# Altium schematic sheet IO_EXPAND.SchDoc
size 420 x 297 mm; SheetNumber: 10; SheetTotal: 19
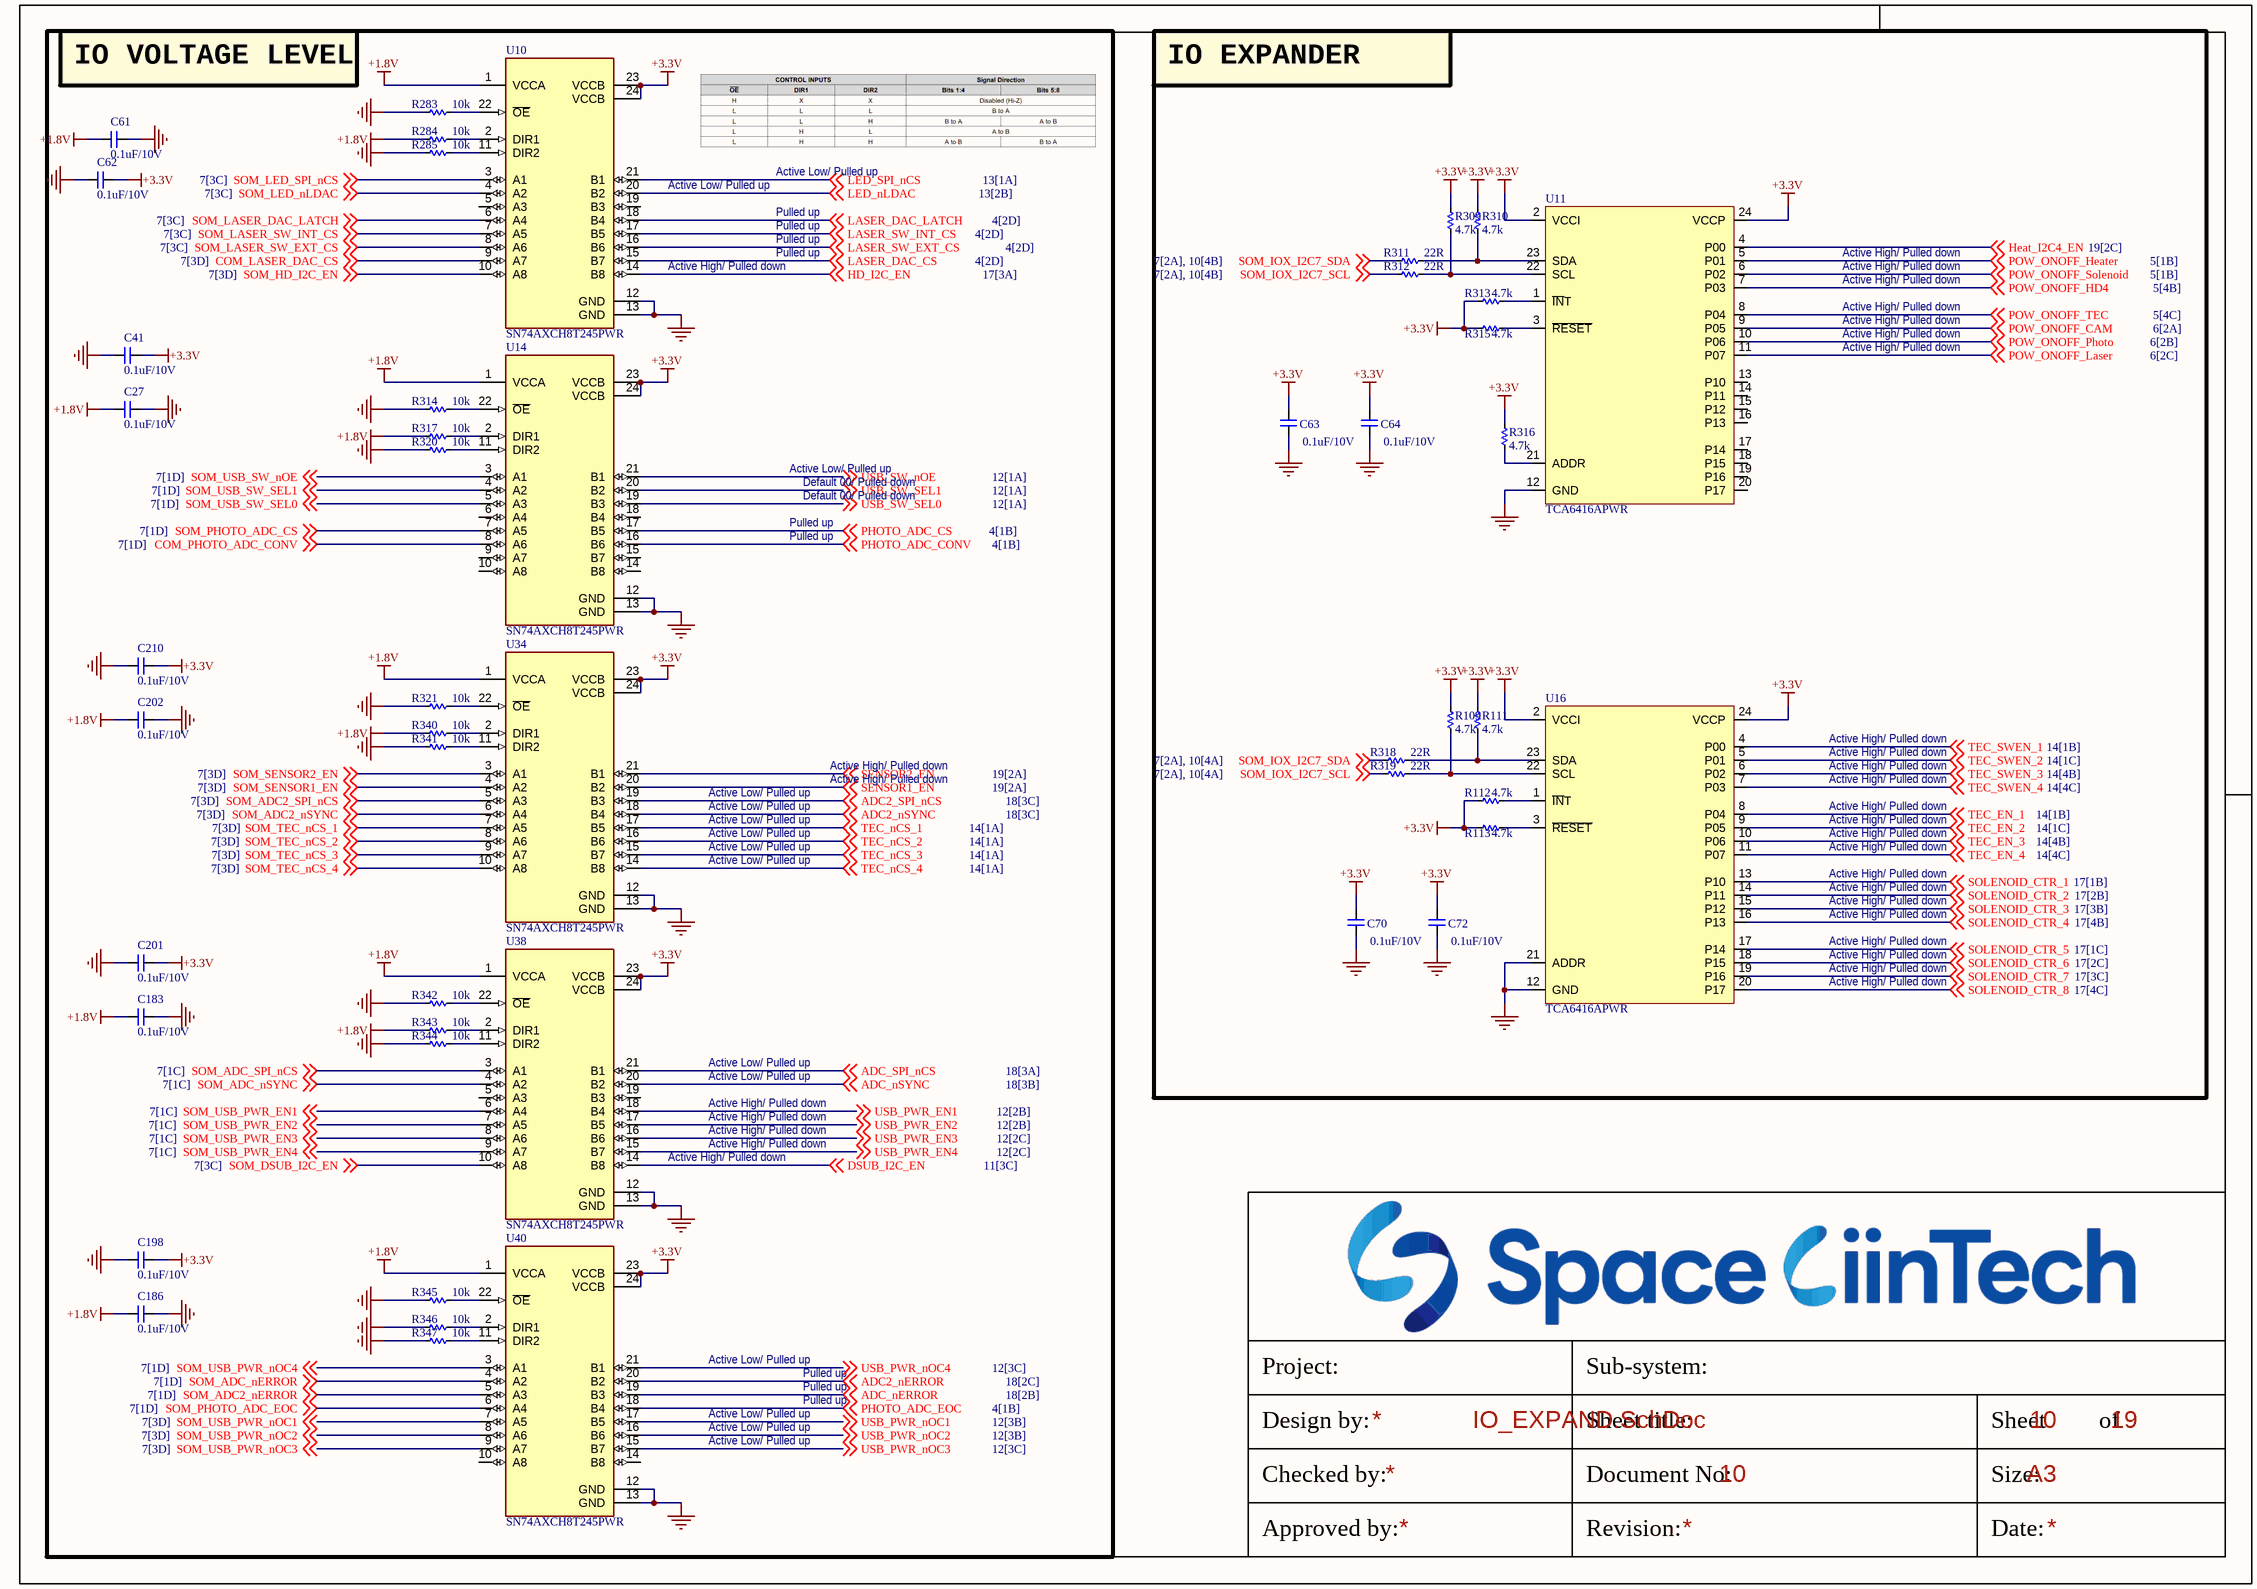
[diagram p0: IO_EXPAND.SchDoc]

## Parts
C27  0.1uF/10V  [CAP_C_1005X60]
C41  0.1uF/10V  [CAP_C_1005X60]
C61  0.1uF/10V  [CAP_C_1005X60]
C62  0.1uF/10V  [CAP_C_1005X60]
C63  0.1uF/10V  [CAP_C_1005X60]
C64  0.1uF/10V  [CAP_C_1005X60]
C70  0.1uF/10V  [CAP_C_1005X60]
C72  0.1uF/10V  [CAP_C_1005X60]
C183  0.1uF/10V  [CAP_C_1005X60]
C186  0.1uF/10V  [CAP_C_1005X60]
C198  0.1uF/10V  [CAP_C_1005X60]
C201  0.1uF/10V  [CAP_C_1005X60]
C202  0.1uF/10V  [CAP_C_1005X60]
C210  0.1uF/10V  [CAP_C_1005X60]
R109  4.7k  [RES_C_1005X40]
R111  4.7k  [RES_C_1005X40]
R112  4.7k  [RES_C_1005X40]
R113  4.7k  [RES_C_1005X40]
R283  10k  [RES_C_1005X40]
R284  10k  [RES_C_1005X40]
R285  10k  [RES_C_1005X40]
R309  4.7k  [RES_C_1005X40]
R310  4.7k  [RES_C_1005X40]
R311  22R  [RES_C_1005X40]
R312  22R  [RES_C_1005X40]
R313  4.7k  [RES_C_1005X40]
R314  10k  [RES_C_1005X40]
R315  4.7k  [RES_C_1005X40]
R316  4.7k  [RES_C_1005X40]
R317  10k  [RES_C_1005X40]
R318  22R  [RES_C_1005X40]
R319  22R  [RES_C_1005X40]
R320  10k  [RES_C_1005X40]
R321  10k  [RES_C_1005X40]
R340  10k  [RES_C_1005X40]
R341  10k  [RES_C_1005X40]
R342  10k  [RES_C_1005X40]
R343  10k  [RES_C_1005X40]
R344  10k  [RES_C_1005X40]
R345  10k  [RES_C_1005X40]
R346  10k  [RES_C_1005X40]
R347  10k  [RES_C_1005X40]
U10  SN74AXCH8T245PWR  [SOP65P640X120-24N]
U11  TCA6416APWR  [SOP65P440W-24N]
U14  SN74AXCH8T245PWR  [SOP65P640X120-24N]
U16  TCA6416APWR  [SOP65P440W-24N]
U34  SN74AXCH8T245PWR  [SOP65P640X120-24N]
U38  SN74AXCH8T245PWR  [SOP65P640X120-24N]
U40  SN74AXCH8T245PWR  [SOP65P640X120-24N]

## Blocks framed on the sheet
IO VOLTAGE LEVEL: C27 C41 C61 C62 C183 C186 C198 C201 C202 C210 R283-R285 R314 R317 R320 R321 R340-R347 U10 U14 U34 U38 U40
IO EXPANDER: C63 C64 C70 C72 R109 R111-R113 R309-R313 R315 R316 R318 R319 U11 U16

## Nets
+1.8V: C27.2 C61.2 C183.2 C186.2 C202.2 R284.2 R317.2 R340.2 R343.2 U10.1(VCCA) U14.1(VCCA) U34.1(VCCA) U38.1(VCCA) U40.1(VCCA)
+3.3V: C41.2 C62.2 C63.2 C64.2 C70.2 C72.2 C198.2 C201.2 C210.2 R109.1 R111.1 R112.1 R113.1 R309.1 R310.1 R313.1 R315.1 R316.2 U10.23(VCCB) U10.24(VCCB) U11.2(VCCI) U11.24(VCCP) U14.23(VCCB) U14.24(VCCB) U16.2(VCCI) U16.24(VCCP) U34.23(VCCB) U34.24(VCCB) U38.23(VCCB) U38.24(VCCB) U40.23(VCCB) U40.24(VCCB)
GND: C27.1 C41.1 C61.1 C62.1 C63.1 C64.1 C70.1 C72.1 C183.1 C186.1 C198.1 C201.1 C202.1 C210.1 R283.2 R285.2 R314.2 R320.2 R321.2 R341.2 R342.2 R344.2 R345.2 R346.2 R347.2 U10.12(GND) U10.13(GND) U11.12(GND) U14.12(GND) U14.13(GND) U16.12(GND) U16.21(ADDR) U34.12(GND) U34.13(GND) U38.12(GND) U38.13(GND) U40.12(GND) U40.13(GND)
ADC2_nERROR: U40.20(B2) ; off-sheet ADC2_nERROR
ADC2_nSYNC: U34.18(B4) ; off-sheet ADC2_nSYNC
ADC2_SPI_nCS: U34.19(B3) ; off-sheet ADC2_SPI_nCS
ADC_nERROR: U40.19(B3) ; off-sheet ADC_nERROR
ADC_nSYNC: U38.20(B2) ; off-sheet ADC_nSYNC
ADC_SPI_nCS: U38.21(B1) ; off-sheet ADC_SPI_nCS
COM_LASER_DAC_CS: U10.9(A7) ; off-sheet COM_LASER_DAC_CS
COM_PHOTO_ADC_CONV: U14.8(A6) ; off-sheet COM_PHOTO_ADC_CONV
DSUB_I2C_EN: U38.14(B8) ; off-sheet DSUB_I2C_EN
HD_I2C_EN: U10.14(B8) ; off-sheet HD_I2C_EN
Heat_I2C4_EN: U11.4(P00) ; off-sheet Heat_I2C4_EN
LASER_DAC_CS: U10.15(B7) ; off-sheet LASER_DAC_CS
LASER_DAC_LATCH: U10.18(B4) ; off-sheet LASER_DAC_LATCH
LASER_SW_EXT_CS: U10.16(B6) ; off-sheet LASER_SW_EXT_CS
LASER_SW_INT_CS: U10.17(B5) ; off-sheet LASER_SW_INT_CS
LED_nLDAC: U10.20(B2) ; off-sheet LED_nLDAC
LED_SPI_nCS: U10.21(B1) ; off-sheet LED_SPI_nCS
PHOTO_ADC_CONV: U14.16(B6) ; off-sheet PHOTO_ADC_CONV
PHOTO_ADC_CS: U14.17(B5) ; off-sheet PHOTO_ADC_CS
PHOTO_ADC_EOC: U40.18(B4) ; off-sheet PHOTO_ADC_EOC
POW_ONOFF_CAM: U11.9(P05) ; off-sheet POW_ONOFF_CAM
POW_ONOFF_HD4: U11.7(P03) ; off-sheet POW_ONOFF_HD4
POW_ONOFF_Heater: U11.5(P01) ; off-sheet POW_ONOFF_Heater
POW_ONOFF_Laser: U11.11(P07) ; off-sheet POW_ONOFF_Laser
POW_ONOFF_Photo: U11.10(P06) ; off-sheet POW_ONOFF_Photo
POW_ONOFF_Solenoid: U11.6(P02) ; off-sheet POW_ONOFF_Solenoid
POW_ONOFF_TEC: U11.8(P04) ; off-sheet POW_ONOFF_TEC
SENSOR1_EN: U34.20(B2) ; off-sheet SENSOR1_EN
SENSOR2_EN: U34.21(B1) ; off-sheet SENSOR2_EN
SOLENOID_CTR_1: U16.13(P10) ; off-sheet SOLENOID_CTR_1
SOLENOID_CTR_2: U16.14(P11) ; off-sheet SOLENOID_CTR_2
SOLENOID_CTR_3: U16.15(P12) ; off-sheet SOLENOID_CTR_3
SOLENOID_CTR_4: U16.16(P13) ; off-sheet SOLENOID_CTR_4
SOLENOID_CTR_5: U16.17(P14) ; off-sheet SOLENOID_CTR_5
SOLENOID_CTR_6: U16.18(P15) ; off-sheet SOLENOID_CTR_6
SOLENOID_CTR_7: U16.19(P16) ; off-sheet SOLENOID_CTR_7
SOLENOID_CTR_8: U16.20(P17) ; off-sheet SOLENOID_CTR_8
SOM_ADC2_nERROR: U40.5(A3) ; off-sheet SOM_ADC2_nERROR
SOM_ADC2_nSYNC: U34.6(A4) ; off-sheet SOM_ADC2_nSYNC
SOM_ADC2_SPI_nCS: U34.5(A3) ; off-sheet SOM_ADC2_SPI_nCS
SOM_ADC_nERROR: U40.4(A2) ; off-sheet SOM_ADC_nERROR
SOM_ADC_nSYNC: U38.4(A2) ; off-sheet SOM_ADC_nSYNC
SOM_ADC_SPI_nCS: U38.3(A1) ; off-sheet SOM_ADC_SPI_nCS
SOM_DSUB_I2C_EN: U38.10(A8) ; off-sheet SOM_DSUB_I2C_EN
SOM_HD_I2C_EN: U10.10(A8) ; off-sheet SOM_HD_I2C_EN
SOM_IOX_I2C7_SCL: R312.1 R319.1 ; off-sheet SOM_IOX_I2C7_SCL
SOM_IOX_I2C7_SDA: R311.1 R318.1 ; off-sheet SOM_IOX_I2C7_SDA
SOM_LASER_DAC_LATCH: U10.6(A4) ; off-sheet SOM_LASER_DAC_LATCH
SOM_LASER_SW_EXT_CS: U10.8(A6) ; off-sheet SOM_LASER_SW_EXT_CS
SOM_LASER_SW_INT_CS: U10.7(A5) ; off-sheet SOM_LASER_SW_INT_CS
SOM_LED_nLDAC: U10.4(A2) ; off-sheet SOM_LED_nLDAC
SOM_LED_SPI_nCS: U10.3(A1) ; off-sheet SOM_LED_SPI_nCS
SOM_PHOTO_ADC_CS: U14.7(A5) ; off-sheet SOM_PHOTO_ADC_CS
SOM_PHOTO_ADC_EOC: U40.6(A4) ; off-sheet SOM_PHOTO_ADC_EOC
SOM_SENSOR1_EN: U34.4(A2) ; off-sheet SOM_SENSOR1_EN
SOM_SENSOR2_EN: U34.3(A1) ; off-sheet SOM_SENSOR2_EN
SOM_TEC_nCS_1: U34.7(A5) ; off-sheet SOM_TEC_nCS_1
SOM_TEC_nCS_2: U34.8(A6) ; off-sheet SOM_TEC_nCS_2
SOM_TEC_nCS_3: U34.9(A7) ; off-sheet SOM_TEC_nCS_3
SOM_TEC_nCS_4: U34.10(A8) ; off-sheet SOM_TEC_nCS_4
SOM_USB_PWR_EN1: U38.6(A4) ; off-sheet SOM_USB_PWR_EN1
SOM_USB_PWR_EN2: U38.7(A5) ; off-sheet SOM_USB_PWR_EN2
SOM_USB_PWR_EN3: U38.8(A6) ; off-sheet SOM_USB_PWR_EN3
SOM_USB_PWR_EN4: U38.9(A7) ; off-sheet SOM_USB_PWR_EN4
SOM_USB_PWR_nOC1: U40.7(A5) ; off-sheet SOM_USB_PWR_nOC1
SOM_USB_PWR_nOC2: U40.8(A6) ; off-sheet SOM_USB_PWR_nOC2
SOM_USB_PWR_nOC3: U40.9(A7) ; off-sheet SOM_USB_PWR_nOC3
SOM_USB_PWR_nOC4: U40.3(A1) ; off-sheet SOM_USB_PWR_nOC4
SOM_USB_SW_nOE: U14.3(A1) ; off-sheet SOM_USB_SW_nOE
SOM_USB_SW_SEL0: U14.5(A3) ; off-sheet SOM_USB_SW_SEL0
SOM_USB_SW_SEL1: U14.4(A2) ; off-sheet SOM_USB_SW_SEL1
TEC_EN_1: U16.8(P04) ; off-sheet TEC_EN_1
TEC_EN_2: U16.9(P05) ; off-sheet TEC_EN_2
TEC_EN_3: U16.10(P06) ; off-sheet TEC_EN_3
TEC_EN_4: U16.11(P07) ; off-sheet TEC_EN_4
TEC_nCS_1: U34.17(B5) ; off-sheet TEC_nCS_1
TEC_nCS_2: U34.16(B6) ; off-sheet TEC_nCS_2
TEC_nCS_3: U34.15(B7) ; off-sheet TEC_nCS_3
TEC_nCS_4: U34.14(B8) ; off-sheet TEC_nCS_4
TEC_SWEN_1: U16.4(P00) ; off-sheet TEC_SWEN_1
TEC_SWEN_2: U16.5(P01) ; off-sheet TEC_SWEN_2
TEC_SWEN_3: U16.6(P02) ; off-sheet TEC_SWEN_3
TEC_SWEN_4: U16.7(P03) ; off-sheet TEC_SWEN_4
USB_PWR_EN1: U38.18(B4) ; off-sheet USB_PWR_EN1
USB_PWR_EN2: U38.17(B5) ; off-sheet USB_PWR_EN2
USB_PWR_EN3: U38.16(B6) ; off-sheet USB_PWR_EN3
USB_PWR_EN4: U38.15(B7) ; off-sheet USB_PWR_EN4
USB_PWR_nOC1: U40.17(B5) ; off-sheet USB_PWR_nOC1
USB_PWR_nOC2: U40.16(B6) ; off-sheet USB_PWR_nOC2
USB_PWR_nOC3: U40.15(B7) ; off-sheet USB_PWR_nOC3
USB_PWR_nOC4: U40.21(B1) ; off-sheet USB_PWR_nOC4
USB_SW_nOE: U14.21(B1) ; off-sheet USB_SW_nOE
USB_SW_SEL0: U14.19(B3) ; off-sheet USB_SW_SEL0
USB_SW_SEL1: U14.20(B2) ; off-sheet USB_SW_SEL1
NetR109_2: R109.2 R319.2 U16.22(SCL)
NetR111_2: R111.2 R318.2 U16.23(SDA)
NetR112_2: R112.2 U16.1(~{IN}T)
NetR113_2: R113.2 U16.3(~{RESET})
NetR283_1: R283.1 U10.22(~{OE})
NetR284_1: R284.1 U10.2(DIR1)
NetR285_1: R285.1 U10.11(DIR2)
NetR309_2: R309.2 R312.2 U11.22(SCL)
NetR310_2: R310.2 R311.2 U11.23(SDA)
NetR313_2: R313.2 U11.1(~{IN}T)
NetR314_1: R314.1 U14.22(~{OE})
NetR315_2: R315.2 U11.3(~{RESET})
NetR316_1: R316.1 U11.21(ADDR)
NetR317_1: R317.1 U14.2(DIR1)
NetR320_1: R320.1 U14.11(DIR2)
NetR321_1: R321.1 U34.22(~{OE})
NetR340_1: R340.1 U34.2(DIR1)
NetR341_1: R341.1 U34.11(DIR2)
NetR342_1: R342.1 U38.22(~{OE})
NetR343_1: R343.1 U38.2(DIR1)
NetR344_1: R344.1 U38.11(DIR2)
NetR345_1: R345.1 U40.22(~{OE})
NetR346_1: R346.1 U40.2(DIR1)
NetR347_1: R347.1 U40.11(DIR2)

Not connected (* = marked no-connect by the designer): U10 5(A3) 19(B3); U11 13(P10) 14(P11) 15(P12) 16(P13) 17(P14) 18(P15) 19(P16) 20(P17); U14 6(A4) 9(A7) 10(A8) 14(B8) 15(B7) 18(B4); U38 5(A3) 19(B3); U40 10(A8) 14(B8)

## Notes on the sheet
- Active Low/ Pulled up
- (near U10) Active Low/ Pulled up
- Pulled up
- Active High/ Pulled down
- (near U14) Active Low/ Pulled up
- (near U14) Default 00/ Pulled down
- Project:
- Sub-system:
- Design by:
- Sheet title:
- Sheet
- of
- Checked by:
- Approved by:
- Revision:
- Document No:
- Size:
- Date:
- A3

## Library data of the parts
C27 C41 C61-C64 C70 C72 C183 C186 C198 C201 C202 C210 = _CAP_C_2: CAP CHIP
R109 R111-R113 R283-R285 R309-R321 R340-R347 = _RES_B_2: RES
U10 U14 U34 U38 U40 = IC_voltage_level_SN74AXCH8T245PWR: 8-Bit Dual-Supply Bus Transceiver; MF: Texas Instruments; MP: SN74AXCH8T245PWR; Value: *; Check_prices: https://www.snapeda.com/parts/SN74AXCH8T245PWR/Texas+Instruments/view-part/?ref=eda; SnapEDA_Link: https://www.snapeda.com/parts/SN74AXCH8T245PWR/Texas+Instruments/view-part/?ref=snap; Price: None; Availability: In Stock; Purchase-URL: https://pricing.snapeda.com/search/part/SN74AXCH8T245PWR/?ref=eda; Package: TSSOP-24 Texas Instruments
U11 U16 = IC_I2Cto16IO_TCA6416APWR